# Altium schematic sheet STM32MP15XXAC_1DDR3Lx16-Top.SchDoc: STM32MP15XXAC_1DDR3Lx16-TOP
size A4; Date: Not used; ApprovedBy: Not used; CheckedBy: Not used; Author: Not used; CompanyName: STMicroelectronics; DrawnBy: Not used; Engineer: Not used; Organization: Not used; Address1: Not used; Address2: Not used; Address3: Not used; Address4: Not used; DocumentNumber: Not used; Revision: Not used; SheetNumber: 2; SheetTotal: 7; CurrentTime: Not used; CurrentDate: Not used; Time: Not used; DocumentFullPathAndName: Not used; DocumentName: Not used; ModifiedDate: Not used; ImagePath: Not used; ProjectName: Not used; Application_BuildNumber: Not used
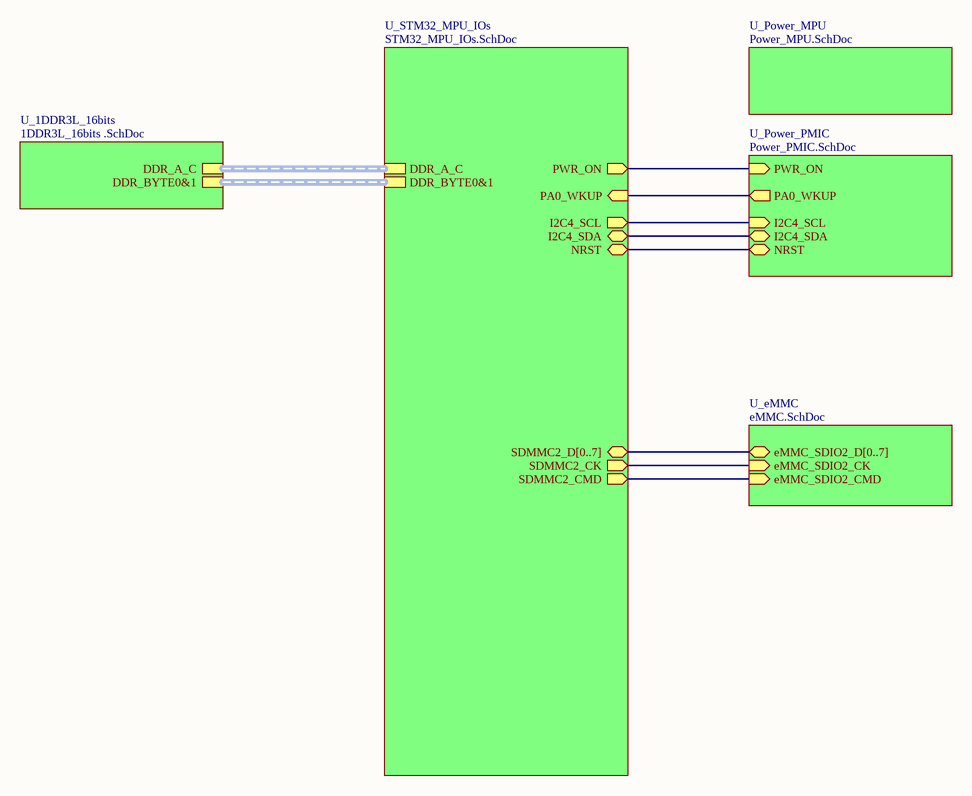
[diagram p0: STM32MP15XXAC_1DDR3Lx16-Top.SchDoc]

## Sub-sheets
U_1DDR3L_16bits = 1DDR3L_16bits .SchDoc: DDR_A_C (harness DDR_A_C), DDR_BYTE0&1 (harness DDR_BYTE_0&1)
U_eMMC = eMMC.SchDoc: eMMC_SDIO2_CK (in), eMMC_SDIO2_D[0..7] (bidir), eMMC_SDIO2_CMD (in)
U_Power_MPU = Power_MPU.SchDoc: no entries
U_Power_PMIC = Power_PMIC.SchDoc: I2C4_SDA (bidir), I2C4_SCL (in), PA0_WKUP (out), NRST (bidir), PWR_ON (in)
U_STM32_MPU_IOs = STM32_MPU_IOs.SchDoc: PA0_WKUP (in), NRST (bidir), PWR_ON (out), I2C4_SCL (out), I2C4_SDA (bidir), DDR_BYTE0&1 (harness DDR_BYTE_0&1), DDR_A_C (harness DDR_A_C), SDMMC2_D[0..7] (bidir), SDMMC2_CMD (out), SDMMC2_CK (out)

## Nets
(unnamed): sheet U_Power_PMIC/I2C4_SDA, sheet U_STM32_MPU_IOs/I2C4_SDA
(unnamed): sheet U_Power_PMIC/I2C4_SCL, sheet U_STM32_MPU_IOs/I2C4_SCL
(unnamed): sheet U_Power_PMIC/PA0_WKUP, sheet U_STM32_MPU_IOs/PA0_WKUP
(unnamed): sheet U_Power_PMIC/NRST, sheet U_STM32_MPU_IOs/NRST
(unnamed): sheet U_Power_PMIC/PWR_ON, sheet U_STM32_MPU_IOs/PWR_ON
(unnamed): sheet U_eMMC/eMMC_SDIO2_CK, sheet U_STM32_MPU_IOs/SDMMC2_CK
(unnamed): sheet U_eMMC/eMMC_SDIO2_CMD, sheet U_STM32_MPU_IOs/SDMMC2_CMD

## Buses and harness runs
bus sheet U_eMMC/eMMC_SDIO2_D[0..7] = sheet U_STM32_MPU_IOs/SDMMC2_D[0..7]
harness sheet U_1DDR3L_16bits/DDR_A_C = sheet U_STM32_MPU_IOs/DDR_A_C
harness sheet U_1DDR3L_16bits/DDR_BYTE0&1 = sheet U_STM32_MPU_IOs/DDR_BYTE0&1

## Notes on the sheet
- Title:
- Project:
- Size:
- Revision:
- Variant:
- A4
- -
- Date:
- Reference:
- Sheet:
- of